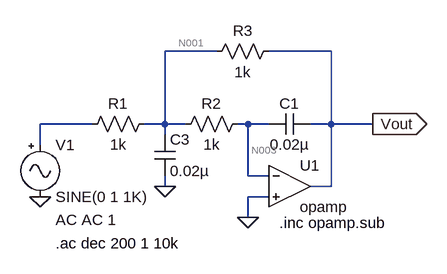
[diagram p0: schematic MFIG lowpass.asc]
MFIG lowpass.asc, the LTspice schematic file:
Version 4
SHEET 1 880 680
WIRE 304 80 224 80
WIRE 480 80 384 80
WIRE 112 192 32 192
WIRE 224 192 224 80
WIRE 224 192 192 192
WIRE 256 192 224 192
WIRE 352 192 336 192
WIRE 384 192 352 192
WIRE 480 192 480 80
WIRE 480 192 448 192
WIRE 544 192 480 192
WIRE 224 208 224 192
WIRE 32 224 32 192
WIRE 352 272 352 192
WIRE 384 272 352 272
WIRE 224 288 224 272
WIRE 480 288 480 192
WIRE 480 288 448 288
WIRE 384 304 352 304
WIRE 352 336 352 304
FLAG 544 192 Vout
IOPIN 544 192 Out
FLAG 32 304 0
FLAG 224 288 0
FLAG 352 336 0
SYMBOL res 208 176 R90
WINDOW 0 0 56 VBottom 2
WINDOW 3 32 56 VTop 2
SYMATTR InstName R1
SYMATTR Value 1k
SYMBOL res 352 176 R90
WINDOW 0 0 56 VBottom 2
WINDOW 3 32 56 VTop 2
SYMATTR InstName R2
SYMATTR Value 1k
SYMBOL Misc\\signal 32 208 R0
WINDOW 123 24 132 Left 2
WINDOW 39 0 0 Left 0
SYMATTR Value2 AC AC 1
SYMATTR InstName V1
SYMBOL cap 208 208 R0
SYMATTR InstName C3
SYMATTR Value 0.02µ
SYMBOL res 400 64 R90
WINDOW 0 0 56 VBottom 2
WINDOW 3 32 56 VTop 2
SYMATTR InstName R3
SYMATTR Value 1k
SYMBOL OpAmps\\opamp 416 224 R0
SYMATTR InstName U1
SYMBOL cap 448 176 R90
WINDOW 0 0 32 VBottom 2
WINDOW 3 32 32 VTop 2
SYMATTR InstName C1
SYMATTR Value 0.02µ
TEXT 56 376 Left 2 !.ac dec 200 1 10k
TEXT 400 344 Left 2 !.inc opamp.sub

The netlist it stands for:
* MFIG lowpass.asc
R1 N001 N002 1k
R2 N003 N001 1k
V1 N002 0 SINE(0 1 1K) AC AC 1
C3 N001 0 0.02µ
R3 Vout N001 1k
XU1 N003 0 Vout opamp Aol=100K GBW=10Meg  ; pins invin noninvin out
C1 Vout N003 0.02µ
.ac dec 200 1 10k
.inc opamp.sub
.backanno
.end

* Results of the author's LTspice run, read from the files saved beside the schematic
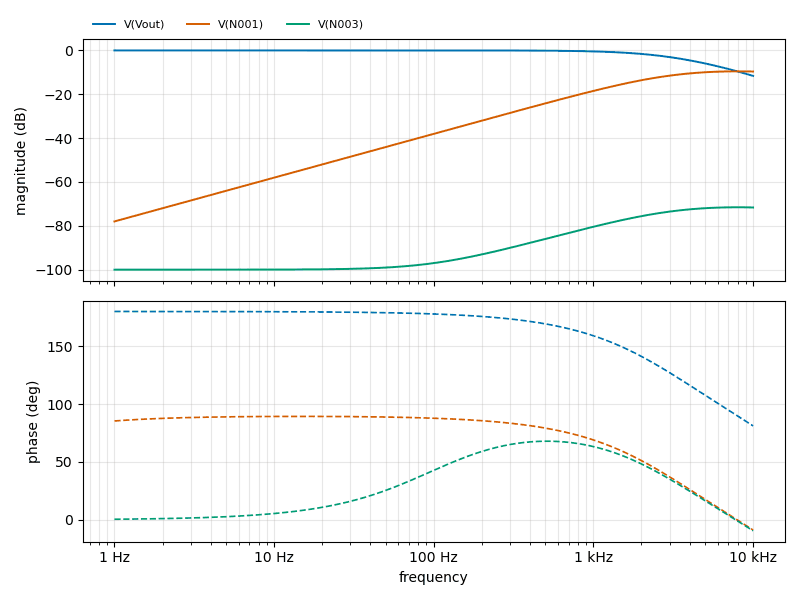
[diagram p1: AC Analysis of MFIG lowpass.asc, plotted from the saved traces]
* AC Analysis, 1 run:
*   V(Vout): -0.00 dB at 1 Hz, -11.63 dB at 10 kHz, peak -0.00 dB at 1 Hz, 3 dB below the peak at 2.977 kHz
*   V(N001): -77.98 dB at 1 Hz, -9.64 dB at 10 kHz, peak -9.54 dB at 7.943 kHz, 3 dB below the peak at 2.409 kHz
*   V(N003): -99.99 dB at 1 Hz, -71.63 dB at 10 kHz, peak -71.53 dB at 7.943 kHz, 3 dB below the peak at 2.406 kHz